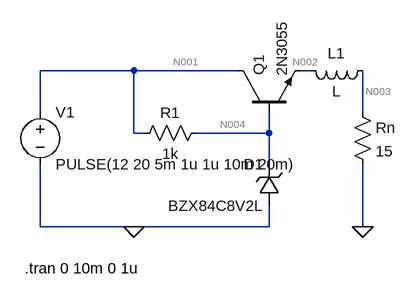
[diagram p0: schematic task2.asc]
task2.asc, the LTspice schematic file:
Version 4.1
SHEET 1 916 680
WIRE 272 48 128 48
WIRE 432 48 272 48
WIRE 544 48 528 48
WIRE 128 112 128 48
WIRE 624 112 624 48
WIRE 272 144 272 48
WIRE 288 144 272 144
WIRE 480 144 480 112
WIRE 480 144 368 144
WIRE 480 192 480 144
WIRE 128 288 128 192
WIRE 272 288 128 288
WIRE 480 288 480 256
WIRE 480 288 272 288
WIRE 624 288 624 192
FLAG 272 288 0
FLAG 624 288 0
SYMBOL voltage 128 96 R0
WINDOW 123 0 0 Left 0
WINDOW 39 0 0 Left 0
SYMATTR InstName V1
SYMATTR Value PULSE(12 20 5m 1u 1u 10m 20m)
SYMBOL res 384 128 R90
WINDOW 0 0 56 VBottom 2
WINDOW 3 32 56 VTop 2
SYMATTR InstName R1
SYMATTR Value 1k
SYMBOL zener 496 256 R180
WINDOW 0 24 64 Left 2
WINDOW 3 24 0 Left 2
SYMATTR InstName D1
SYMATTR Value BZX84C8V2L
SYMBOL npn 432 112 R270
SYMATTR InstName Q1
SYMATTR Value 2N3055
SYMBOL res 608 96 R0
SYMATTR InstName Rn
SYMATTR Value 15
SYMBOL ind 640 32 R90
WINDOW 0 5 56 VBottom 2
WINDOW 3 32 56 VTop 2
SYMATTR InstName L1
TEXT 104 352 Left 2 !.tran 0 10m 0 1u

The netlist it stands for:
* task2.asc
V1 N001 0 PULSE(12 20 5m 1u 1u 10m 20m)
R1 N004 N001 1k
D1 0 N004 BZX84C8V2L
Q1 N001 N004 N002 0 2N3055
Rn N003 0 15
L1 N003 N002 L
.model D D
.lib standard.dio
.model NPN NPN
.model PNP PNP
.lib standard.bjt
.tran 0 10m 0 1u
.backanno
.end

* Results of the author's LTspice run, read from the files saved beside the schematic
* Operating Point, zero values left out:
*   V(n001) = 12 V
*   V(n002) = 5.244 V
*   V(n003) = 5.244 V
*   V(n004) = 5.684 V
*   I(D1) = -805.7 pA
*   I(L1) = -349.6 mA
*   I(R1) = -6.316 mA
*   I(Rn) = 349.6 mA
*   I(V1) = -349.6 mA
*   Ib(Q1) = 6.316 mA
*   Ic(Q1) = 343.3 mA
*   Ie(Q1) = -349.6 mA
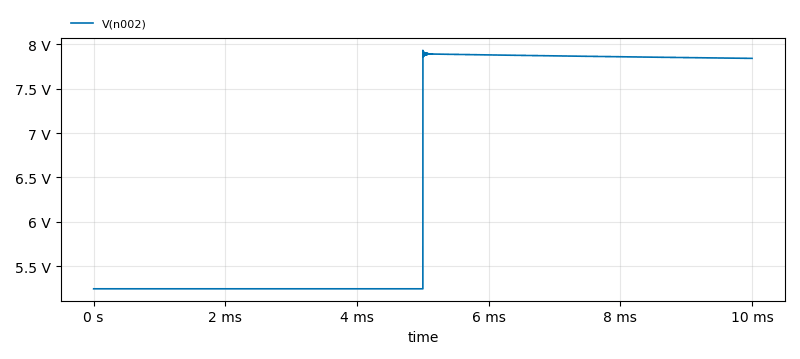
[diagram p1: Transient Analysis of task2.asc, plotted from the saved traces]
* Transient Analysis, 1 run:
*   V(n002): min 5.244 V, max 7.933 V, average 6.555 V, rms 6.685 V, last 7.843 V